# EAGLE design stm32board (EAGLE 9.6.2)
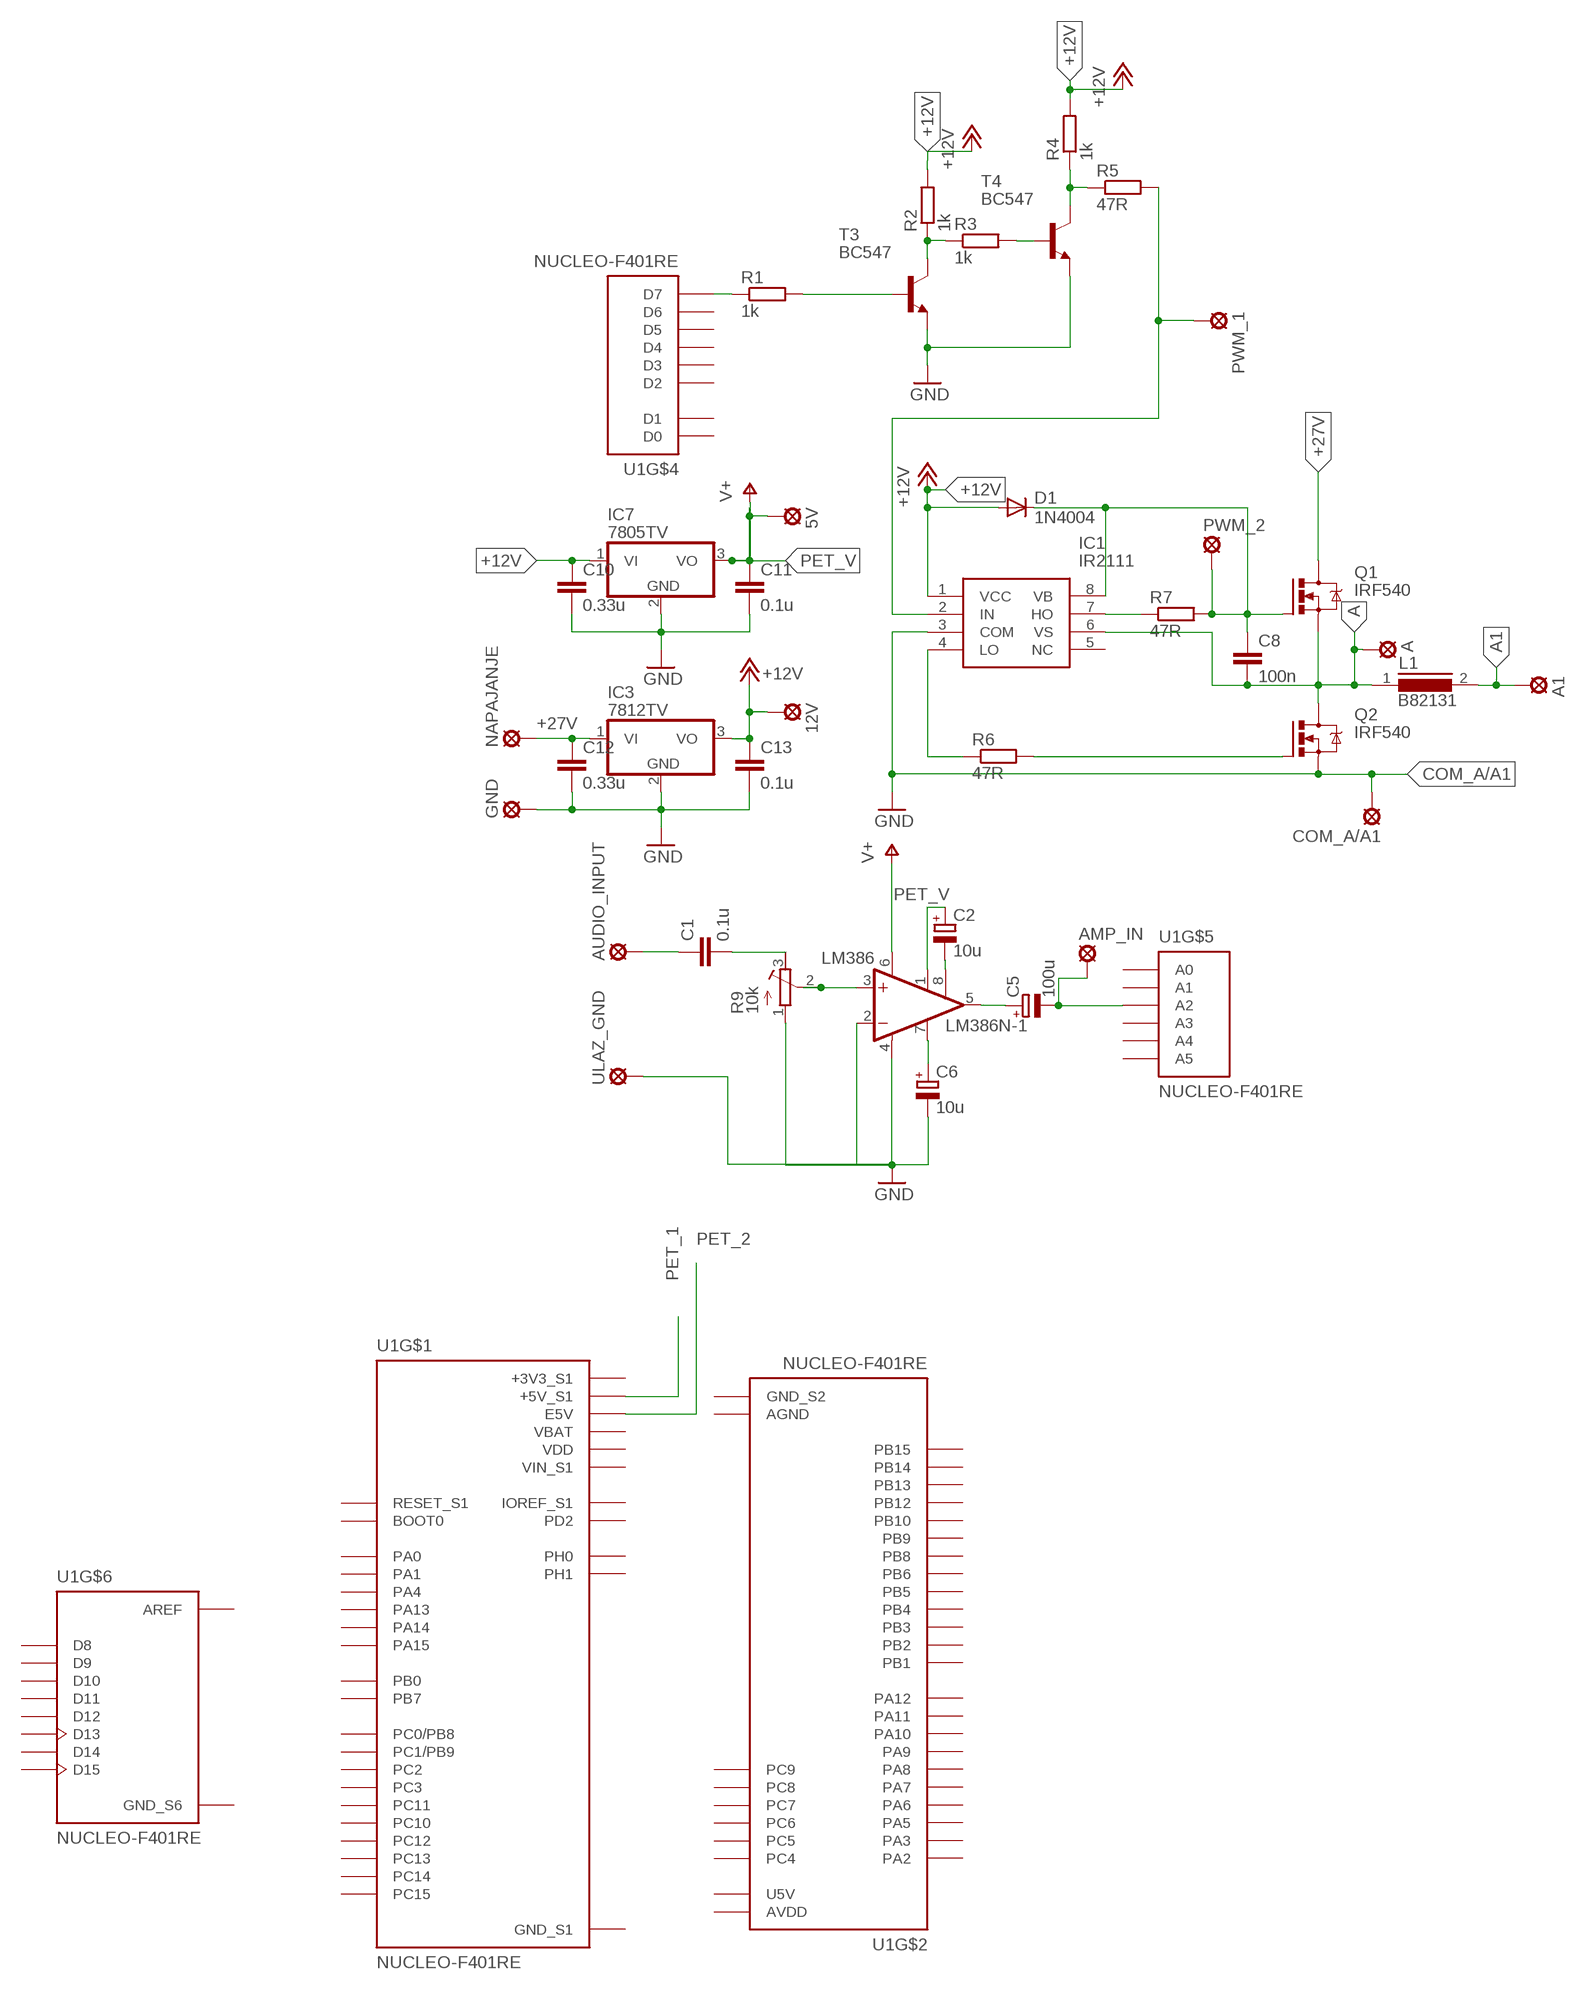
[diagram p0: schematic, sheet 1]

## Parts
5V  LSP10  [LSP10]
12V  LSP10  [LSP10]
A  LSP10  [LSP10]
A1  LSP10  [LSP10]
AMP_IN  LSP10  [LSP10]
AUDIO_INPUT  LSP10  [LSP10]
C1  0.1u  C-EU050-030X075  [C050-030X075]
C2  10u  CPOL-EUE2,5-6E  [E2,5-6E]
C5  100u  CPOL-EUE2,5-6E  [E2,5-6E]
C6  10u  CPOL-EUE2,5-6E  [E2,5-6E]
C8  100n  C-EU050-030X075  [C050-030X075]
C10  0.33u  C-EU050-030X075  [C050-030X075]
C11  0.1u  C-EU050-030X075  [C050-030X075]
C12  0.33u  C-EU050-030X075  [C050-030X075]
C13  0.1u  C-EU050-030X075  [C050-030X075]
COM_A/A1  LSP10  [LSP10]
D1  1N4004  [DO41-10]
GND  LSP10  [LSP10]
IC1  IR2111  [DIP762W56P254L988H533Q8N]
IC3  7812TV  [TO220V]
IC7  7805TV  [TO220V]
L1  B82131  [SUKW1-17]
LM386  LM386N-1  [DIL08]
NAPAJANJE  LSP10  [LSP10]
PWM_1  LSP10  [LSP10]
PWM_2  LSP10  [LSP10]
Q1  IRF540  [TO220BV]
Q2  IRF540  [TO220BV]
R1  1k  R-EU_0207/12  [0207/12]
R2  1k  R-EU_0207/12  [0207/12]
R3  1k  R-EU_0207/12  [0207/12]
R4  1k  R-EU_0207/12  [0207/12]
R5  47R  R-EU_0207/12  [0207/12]
R6  47R  R-EU_0207/12  [0207/12]
R7  47R  R-EU_0207/12  [0207/12]
R9  10k  R-TRIMM3339P  [RTRIM3339P]
T3  BC547  [TO92]
T4  BC547  [TO92]
U1  NUCLEO-F401RE  [ST_NUCLEO-F401RE]
ULAZ_GND  LSP10  [LSP10]

## Nets
+12V: 12V.MP C10.1 C13.1 D1.A IC1.1(VCC) IC3.3(VO) IC7.1(VI) R2.2 R4.2
+27V: C12.1 IC3.1(VI) NAPAJANJE.MP Q1.D
A: A.MP C8.2 IC1.6(VS) L1.1 Q1.S Q2.D
A1: A1.MP L1.2
AUDIO_INPUT: AUDIO_INPUT.MP C1.1
COM_A/A1: COM_A/A1.MP IC1.3(COM) Q2.S ; supply symbol labelled GND
GND: C6.- C10.2 C11.2 C12.2 C13.2 GND.MP IC3.2(GND) IC7.2(GND) LM386.2(-IN) LM386.4(GND) R9.1(A) T3.1(E) T4.1(E) ULAZ_GND.MP
N$1: C5.+ LM386.5(OUT)
N$2: AMP_IN.MP C5.- U1.CN8_3(A2)
N$3: C2.- LM386.8(GAIN)
N$4: C6.+ LM386.7(BYPASS)
N$5: R1.1 U1.CN9_8(D7)
N$7: C1.2 R9.3(E)
N$8: C2.+ LM386.1(GAIN)
N$9: LM386.3(+IN) R9.2(S)
N$10: R1.2 T3.2(B)
N$11: R2.1 R3.1 T3.3(C)
N$12: R4.1 R5.1 T4.3(C)
N$13: R3.2 T4.2(B)
N$18: IC1.7(HO) R7.1
N$19: C8.1 D1.C IC1.8(VB) PWM_2.MP Q1.G R7.2
N$21: IC1.4(LO) R6.1
N$22: Q2.G R6.2
N$24: IC1.2(IN) PWM_1.MP R5.2
PET_1: U1.CN7_18(+5V_S1)
PET_2: U1.CN7_6(E5V)
PET_V: 5V.MP C11.1 IC7.3(VO) LM386.6(VS) ; supply symbol labelled V+
Unconnected: IC1.5(NC) U1.CN5_1(D8) U1.CN5_2(D9) U1.CN5_3(D10) U1.CN5_4(D11) U1.CN5_5(D12) U1.CN5_6(D13) U1.CN5_9(D14) U1.CN5_10(D15) U1.CN6_2(IOREF) U1.CN6_3(RESET) U1.CN7_1(PC10) U1.CN7_2(PC11) U1.CN7_3(PC12) U1.CN7_4(PD2) U1.CN7_7(BOOT0) U1.CN7_12(IOREF_S1) U1.CN7_13(PA13) U1.CN7_14(RESET_S1) U1.CN7_15(PA14) U1.CN7_17(PA15) U1.CN7_21(PB7) U1.CN7_23(PC13) U1.CN7_25(PC14) U1.CN7_27(PC15) U1.CN7_28(PA0) U1.CN7_29(PH0) U1.CN7_30(PA1) U1.CN7_31(PH1) U1.CN7_32(PA4) U1.CN7_34(PB0) U1.CN7_35(PC2) U1.CN7_36(PC1/PB9) U1.CN7_37(PC3) U1.CN7_38(PC0/PB8) U1.CN8_1(A0) U1.CN8_2(A1) U1.CN8_4(A3) U1.CN8_5(A4) U1.CN8_6(A5) U1.CN9_1(D0) U1.CN9_2(D1) U1.CN9_3(D2) U1.CN9_4(D3) U1.CN9_5(D4) U1.CN9_6(D5) U1.CN9_7(D6) U1.CN10_1(PC9) U1.CN10_2(PC8) U1.CN10_3(PB8) U1.CN10_4(PC6) U1.CN10_5(PB9) U1.CN10_6(PC5) U1.CN10_11(PA5) U1.CN10_12(PA12) U1.CN10_13(PA6) U1.CN10_14(PA11) U1.CN10_15(PA7) U1.CN10_16(PB12) U1.CN10_17(PB6) U1.CN10_19(PC7) U1.CN10_21(PA9) U1.CN10_22(PB2) U1.CN10_23(PA8) U1.CN10_24(PB1) U1.CN10_25(PB10) U1.CN10_26(PB15) U1.CN10_27(PB4) U1.CN10_28(PB14) U1.CN10_29(PB5) U1.CN10_30(PB13) U1.CN10_31(PB3) U1.CN10_33(PA10) U1.CN10_34(PC4) U1.CN10_35(PA2) U1.CN10_37(PA3)

## Power pins joined to a net without a drawn wire
+3V3: U1.CN6_4(+3V3)
+3V3_S1: U1.CN7_16(+3V3_S1)
AGND: U1.CN10_32(AGND)
AREF: U1.CN5_8(AREF)
AVDD: U1.CN10_7(AVDD)
GND: U1.CN6_6(GND) U1.CN6_7(GND)
GND_S1: U1.CN7_8(GND_S1) U1.CN7_19(GND_S1) U1.CN7_20(GND_S1) U1.CN7_22(GND_S1)
GND_S2: U1.CN10_9(GND_S2) U1.CN10_20(GND_S2)
GND_S6: U1.CN5_7(GND_S6)
PET_V: U1.CN6_5(+5V)
U5V: U1.CN10_8(U5V)
VBAT: U1.CN7_33(VBAT)
VDD: U1.CN7_5(VDD)
VIN: U1.CN6_8(VIN)
VIN_S1: U1.CN7_24(VIN_S1)

## Library data of the parts
5V 12V A A1 AMP_IN AUDIO_INPUT COM_A/A1 GND NAPAJANJE PWM_1 PWM_2 ULAZ_GND = solpad:LSP10: SOLDER PAD drill 1.0 mm, distributor Buerklin, 12H555
C1 C8 C10-C13 = rcl:C-EU: CAPACITOR, European symbol; SPICEPREFIX: C
C2 C5 C6 = rcl:CPOL-EU: POLARIZED CAPACITOR, European symbol; SPICEPREFIX: C
D1 = adafruit:1N4004: DIODE General purpose 1N400x type rectifier (With bigger pads) http://www.ladyada.net/library/pcb/eaglelibrary.html
IC1 = IR2111:IR2111: MOSFET/IGBT driver IR2111 DIP8 200mA Source: Datasheet <http://uk.rs-online.com/web/p/products/1890501>; DESCRIPTION: MOSFET/IGBT driver IR2111 DIP8 200mA; HEIGHT: 5.33mm; MANUFACTURER_NAME: Infineon; MANUFACTURER_PART_NUMBER: IR2111
IC3 IC7 = linear:78*: Positive VOLTAGE REGULATOR Source: http://cache.national.com/ds/LM/LM78L05.pdf http://www.fairchildsemi.com/ds/LM/LM7805.pdf
L1 = inductors:B82131: INDUCTOR; SPICEPREFIX: L
LM386 = linear:LM386?-*: Low Voltage Audio Power Amplifier Source: http://cache.national.com/ds/LM/LM386.pdf
Q1 Q2 = transistor-power:IRF540: HEXFET Power MOSFET
R1-R7 = rcl:R-EU_: RESISTOR, European symbol; SPICEPREFIX: R
R9 = rcl:R-TRIMM: Trimm resistor; SPICEMODEL: X; SPICEPREFIXL: POT
T3 T4 = transistor:BC547: NPN TRANSISTOR
U1 = NUCLEO-F401RE:NUCLEO-F401RE: STM32 Nucleo-64 development board with STM32F401RET6 MCU, supports Arduino and ST morpho connectivity Check availability <https://pricing.snapeda.com/parts/NUCLEO-F401RE/STMicroelectronics/view-part?ref=eda>; AVAILABILITY: In Stock; DESCRIPTION: STM32F401RE, mbed-Enabled Development Nucleo-64 STM32F4 ARM® Cortex®-M4 MCU 32-Bit Embedded Evaluation Board; MF: STMicroelectronics; MP: NUCLEO-F401RE; PACKAGE: None; PRICE: None; PURCHASE-URL: https://pricing.snapeda.com/search/part/NUCLEO-F401RE/?ref=eda

## Board
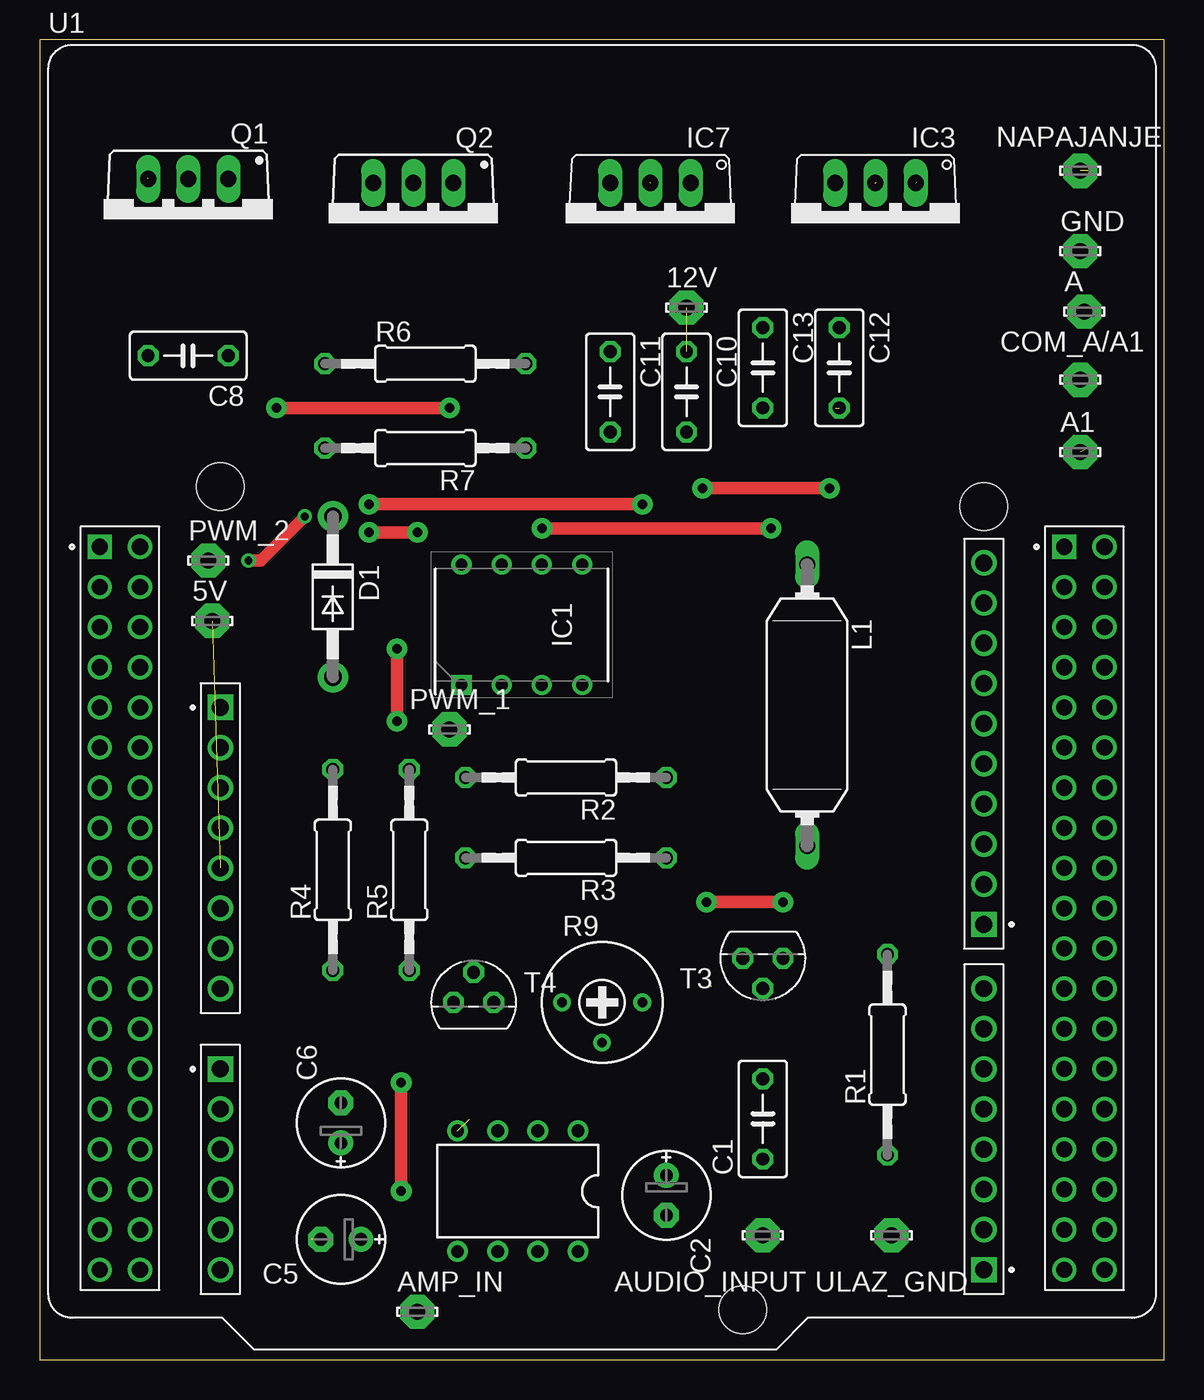
[diagram p1: board, top side]
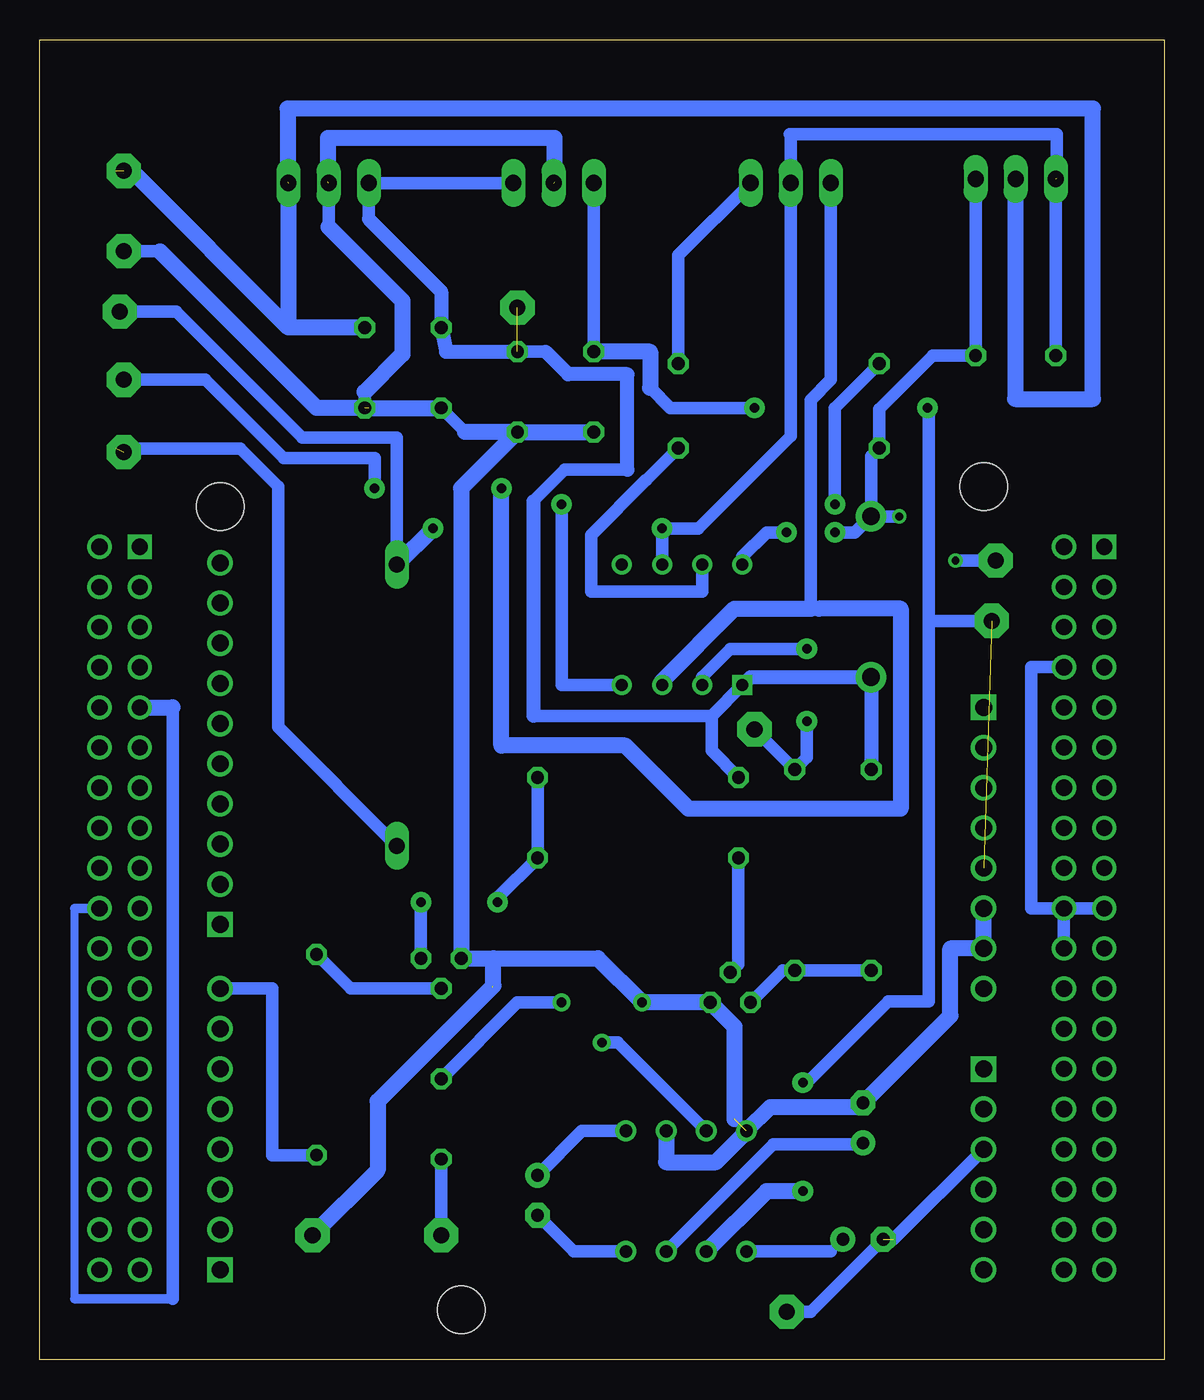
[diagram p2: board, bottom side, seen from below]

Size 71.1 x 83.49 mm. Coordinates in mm from the lower left corner, seen from the top.
Outline: 0,0 71.1,0 71.1,83.49 0,83.49 0,0
Copper layers (1*16): Top 0.035mm / dielectric 1.5mm / Bottom 0.035mm
Design rules "default *": minimum track width 0.8mm, minimum drill 0.5mm, track to track 10mil, track to pad 10mil, pad to pad 10mil, via to via 10mil, smd to smd 10mil, copper to edge 70mil, drill to drill 15mil, minimum pad ring 10mil, minimum via ring 8mil, stop-mask expansion 4mil, vias tented up to drill 0mil, thermal gap 10mil

### Footprints (pad centres in the part's own frame; a part is rotated, then mirrored left to right if it is on the bottom)
LSP10 = drill 1.016 pad 2.159 octagon: MP 0,0
C050-030X075 = drill 0.813 octagon: 1 -2.54,0; 2 2.54,0
E2,5-6E = drill 0.813 pad 1.575: + -1.27,0 | drill 0.813 pad 1.575 octagon: - 1.27,0
DO41-10 = drill 1.118 pad 1.93: A 5.08,0; C -5.08,0
DIP762W56P254L988H533Q8N = drill 0.758 pad 1.158 square: 1 -3.81,3.81 | drill 0.758 pad 1.158: 2 -3.81,1.27; 3 -3.81,-1.27; 4 -3.81,-3.81; 5 3.81,-3.81; 6 3.81,-1.27; 7 3.81,1.27; 8 3.81,3.81
TO220V = drill 1.016 long: 1 -2.54,-2.54; 2 0,-2.54; 3 2.54,-2.54
SUKW1-17 = drill 1.016 long: 1 -8.89,0; 2 8.89,0
DIL08 = drill 0.813 pad 1.27: 1 -3.81,-3.81; 2 -1.27,-3.81; 3 1.27,-3.81; 4 3.81,-3.81; 5 3.81,3.81; 6 1.27,3.81; 7 -1.27,3.81; 8 -3.81,3.81
TO220BV = drill 1.016 long: D 0,-2.54; G -2.54,-2.54; S 2.54,-2.54
0207/12 = drill 0.813 octagon: 1 -6.35,0; 2 6.35,0
RTRIM3339P = drill 0.61: 1 -2.54,0; 2 0,-2.54; 3 2.54,0
TO92 = drill 0.813 octagon: 1 1.27,0; 2 0,1.905; 3 -1.27,0
ST_NUCLEO-F401RE = drill 1.07 square: CN5_1 24.13,-14.37; CN6_1 -24.13,-0.65; CN8_1 -24.13,-23.51; CN9_1 24.13,-36.21 | drill 1.07: CN5_2 24.13,-11.83; CN5_3 24.13,-9.29; CN5_4 24.13,-6.75; CN5_5 24.13,-4.21; CN5_6 24.13,-1.67; CN5_7 24.13,0.87; CN5_8 24.13,3.41; CN5_9 24.13,5.95; CN5_10 24.13,8.49; CN6_2 -24.13,-3.19; CN6_3 -24.13,-5.73; CN6_4 -24.13,-8.27; CN6_5 -24.13,-10.81; CN6_6 -24.13,-13.35; CN6_7 -24.13,-15.89; CN6_8 -24.13,-18.43; CN8_2 -24.13,-26.05; CN8_3 -24.13,-28.59; CN8_4 -24.13,-31.13; CN8_5 -24.13,-33.67; CN8_6 -24.13,-36.21; CN9_2 24.13,-33.67; CN9_3 24.13,-31.13; CN9_4 24.13,-28.59; CN9_5 24.13,-26.05; CN9_6 24.13,-23.51; CN9_7 24.13,-20.97; CN9_8 24.13,-18.43 | drill 1.02 square: CN7_1 -31.75,9.51; CN10_1 29.21,9.51 | drill 1.02: CN7_2 -29.21,9.51; CN7_3 -31.75,6.97; CN7_4 -29.21,6.97; CN7_5 -31.75,4.43; CN7_6 -29.21,4.43; CN7_7 -31.75,1.89; CN7_8 -29.21,1.89; CN7_9 -31.75,-0.65; CN7_10 -29.21,-0.65; CN7_11 -31.75,-3.19; CN7_12 -29.21,-3.19; CN7_13 -31.75,-5.73; CN7_14 -29.21,-5.73; CN7_15 -31.75,-8.27; CN7_16 -29.21,-8.27; CN7_17 -31.75,-10.81; CN7_18 -29.21,-10.81; CN7_19 -31.75,-13.35; CN7_20 -29.21,-13.35; CN7_21 -31.75,-15.89; CN7_22 -29.21,-15.89; CN7_23 -31.75,-18.43; CN7_24 -29.21,-18.43; CN7_25 -31.75,-20.97; CN7_26 -29.21,-20.97; CN7_27 -31.75,-23.51; CN7_28 -29.21,-23.51; CN7_29 -31.75,-26.05; CN7_30 -29.21,-26.05; CN7_31 -31.75,-28.59; CN7_32 -29.21,-28.59; CN7_33 -31.75,-31.13; CN7_34 -29.21,-31.13; CN7_35 -31.75,-33.67; CN7_36 -29.21,-33.67; CN7_37 -31.75,-36.21; CN7_38 -29.21,-36.21; CN10_2 31.75,9.51; CN10_3 29.21,6.97; CN10_4 31.75,6.97; CN10_5 29.21,4.43; CN10_6 31.75,4.43; CN10_7 29.21,1.89; CN10_8 31.75,1.89; CN10_9 29.21,-0.65; CN10_10 31.75,-0.65; CN10_11 29.21,-3.19; CN10_12 31.75,-3.19; CN10_13 29.21,-5.73; CN10_14 31.75,-5.73; CN10_15 29.21,-8.27; CN10_16 31.75,-8.27; CN10_17 29.21,-10.81; CN10_18 31.75,-10.81; CN10_19 29.21,-13.35; CN10_20 31.75,-13.35; CN10_21 29.21,-15.89; CN10_22 31.75,-15.89; CN10_23 29.21,-18.43; CN10_24 31.75,-18.43; CN10_25 29.21,-20.97; CN10_26 31.75,-20.97; CN10_27 29.21,-23.51; CN10_28 31.75,-23.51; CN10_29 29.21,-26.05; CN10_30 31.75,-26.05; CN10_31 29.21,-28.59; CN10_32 31.75,-28.59; CN10_33 29.21,-31.13; CN10_34 31.75,-31.13; CN10_35 29.21,-33.67; CN10_36 31.75,-33.67; CN10_37 29.21,-36.21; CN10_38 31.75,-36.21 | hole 3: 8.89,-38.75; 24.13,12.05; -24.13,13.32

### Placement (x,y rotation side)
5V  10.92,46.74 0 top
12V  40.89,66.55 0 top
A  66.04,66.29 0 top
A1  65.79,57.4 0 top
AMP_IN  23.88,3.05 0 top
AUDIO_INPUT  45.72,7.87 0 top
C1  45.72,15.24 90 top
C2  39.62,10.41 270 top
C5  19.05,7.62 180 top
C6  19.05,14.99 90 top
C8  9.4,63.5 180 top
C10  40.89,61.21 270 top
C11  36.07,61.21 270 top
C12  50.55,62.74 270 top
C13  45.72,62.74 270 top
COM_A/A1  65.79,61.98 0 top
D1  18.54,48.26 270 top
GND  65.79,70.1 0 top
IC1  30.48,46.48 90 top
IC3  52.83,71.88 180 top
IC7  38.61,71.88 180 top
L1  48.51,41.4 270 top
LM386  30.23,10.67 180 top
NAPAJANJE  65.79,75.18 0 top
PWM_1  25.91,39.88 0 top
PWM_2  10.67,50.55 0 top
Q1  9.4,72.14 180 top
Q2  23.62,71.88 180 top
R1  53.59,19.3 90 top
R2  33.27,36.83 180 top
R3  33.27,31.75 180 top
R4  18.54,30.99 90 top
R5  23.37,30.99 90 top
R6  24.38,62.99 0 top
R7  24.38,57.66 180 top
R9  35.56,22.61 0 top
T3  45.72,25.4 180 top
T4  27.43,22.61 0 top
U1  35.56,41.91 0 top
ULAZ_GND  53.85,7.87 0 top

### Tracks (layer width: path | path; a pad name or v marks a point on that pad's centre or on a via)
+12V  (1 unrouted)
  Bottom 0.8: 50.29,72.14 IC3.3 IC7.1 | 39.12,63.75 C10.1 | 39.89,54.3 37.9,56.29 33.94,56.29 | 39.89,40.72 28.62,40.72 | 28.62,40.72 IC1.1 | R2.2 28.62,38.52 28.62,40.72
  Bottom 0.9: IC1.1 26.16,43.18 D1.A R4.2 | 50.29,72.14 45.72,67.56 C13.1 45.4,63.75 C10.1 | 39.89,54.3 39.89,40.72 | 33.94,56.29 33.94,62.33 37.69,62.33 39.12,63.75
+27V  (2 unrouted)
  Bottom 0.8: Q1.D 9.44,74.63 | 65.28,75.18 66.29,75.18
  Bottom 1: IC3.1 55.37,65.28 | C12.1 55.37,65.28 | 55.42,74.47 55.42,79.13 4.53,79.13 4.53,60.76 9.44,60.76 9.44,74.63 | 55.37,65.28 65.28,75.18
A  (via drill 0.6 pad 1.3)  (1 unrouted)
  Top 0.8: v31.75,52.58 v46.23,52.58
  Bottom 0.8: 6.81,74.72 6.81,77.52 23.67,77.52 23.62,77.47 Q2.D 23.62,58.42 29.46,52.58 v31.75,52.58 IC1.6 | C8.2 Q1.S | L1.1 48.51,58.33 54.48,58.33 62.45,66.29 A.MP
  Bottom 1: v46.23,52.58 L1.1
A1  (1 unrouted)
  Bottom 0.8: L1.2 56.01,40.01 56.01,55.23 58.42,57.64 66.27,57.64 66.29,57.66
AUDIO_INPUT
  Bottom 0.8: AUDIO_INPUT.MP C1.1
COM_A/A1  (via drill 0.6 pad 1.3)
  Top 0.8: v49.92,55.12 v41.91,55.12
  Bottom 0.6: 21.84,47.5 22.35,47.5
  Bottom 0.8: Q2.S 21.08,61.98 22.35,60.71 22.35,47.5 | v49.92,55.12 49.92,57.02 55.68,57.02 60.64,61.98 COM_A/A1.MP
  Bottom 1: v41.91,55.12 41.91,38.85 34.07,38.85 30.07,34.85 16.67,34.85 16.67,47.5 21.84,47.5 | 22.35,47.5 27.18,47.5 31.75,42.93 IC1.3
GND  (5 unrouted)
  Bottom 0.6: LM386.4 26.42,14.43
  Bottom 0.8: 44.2,58.67 C13.2 | IC3.2 52.83,71.63 | 50.55,61.21 C12.2 | 63.5,70.1 GND.MP
  Bottom 1: 42.42,25.4 T3.1 44.45,55.12 C10.2 | 42.42,25.4 35.81,25.4 R9.1 T4.1 27.18,21.08 27.18,15.24 | U1.CN6_6 U1.CN6_7 13.54,26.02 13.54,21.77 C6.- 19.3,16 24.89,16 LM386.4 | ULAZ_GND.MP 49.73,11.99 49.73,16.36 42.48,23.6 | 38.56,74.47 38.56,77.26 52.88,77.26 52.88,74.47 | C10.2 C11.2 | 50.29,60.2 C13.2 | LM386.2 31.5,12.5 28.35,12.5 26.42,14.43 | 42.42,23.67 42.42,25.4 | C10.2 44.2,58.67 | 52.83,71.63 48.16,66.97 48.16,63.59 50.55,61.21 | C12.2 53.59,60.2 63.5,70.1
GND_S1
  Bottom 0.8: U1.CN7_19 U1.CN7_20 | U1.CN7_20 U1.CN7_22 | U1.CN7_20 8.43,28.56 8.43,43.8 U1.CN7_8
GND_S2
  Bottom 0.5: 68.88,3.87 68.88,28.56
  Bottom 0.6: 62.69,3.87 68.88,3.87 | U1.CN10_20 68.88,28.56
  Bottom 0.8: 62.69,41.26 62.69,3.87
  Bottom 1: U1.CN10_9 62.69,41.26
N$1
  Bottom 0.6: C5.+ 21.08,6.86
  Bottom 0.8: 21.08,6.86 LM386.5
N$2  (1 unrouted)
  Bottom 0.8: 17.13,7.62 U1.CN8_3 | C5.- 22.35,3.05 AMP_IN.MP
N$3
  Bottom 0.8: LM386.8 37.34,6.86 C2.-
N$4
  Bottom 0.6: C6.+ 19.14,13.62
  Bottom 0.8: 19.14,13.62 24.73,13.62 LM386.7
N$5
  Bottom 0.8: R1.1 56.39,12.95 56.39,23.48 U1.CN9_8
N$7
  Bottom 0.8: R9.3 40.89,22.61 C1.2
N$8
  Bottom 0.8: C2.+ 36.83,14.48 LM386.1
N$9
  Bottom 0.8: R9.2 34.54,20.07 LM386.3
N$10
  Bottom 0.8: T3.2 51.44,23.5 R1.2
N$11  (via drill 0.6 pad 1.3)
  Top 0.8: v46.99,28.96 v42.16,28.96
  Bottom 0.6: v42.16,28.96 42.16,29.21
  Bottom 0.8: T3.3 v46.99,28.96 | 42.16,29.21 R3.1 R2.1
N$12
  Bottom 0.6: 24.13,24.64 R5.1
  Bottom 0.8: T4.3 24.13,24.64 | R5.1 R4.1
N$13
  Bottom 0.8: R3.2 26.92,25.02 T4.2
N$18
  Bottom 0.8: IC1.7 29.21,48.6 36.24,48.6 36.24,52.16 32.77,55.63 R7.1
N$19  (via drill 0.5, 0.6 pad 1.3)
  Top 0.8: v23.88,52.32 v20.83,52.32 | v16.76,53.34 13.97,50.55 v13.21,50.55
  Bottom 0.8: Q1.G C8.1 14.66,63.5 18.03,60.12 R7.2 18.54,57.15 D1.C | IC1.8 26.67,50.8 25.15,52.32 v23.88,52.32 | v20.83,52.32 19.56,52.32 D1.C | D1.C v16.76,53.34 | v13.21,50.55 PWM_2.MP
N$21  (via drill 0.6 pad 1.3)
  Top 0.8: v38.1,54.1 25.4,54.1 v20.83,54.1
  Bottom 0.8: IC1.4 38.1,42.67 v38.1,54.1 | v20.83,54.1 20.83,60.2 R6.1
N$22
  Bottom 0.8: Q2.G 30.73,69.85 R6.2
N$24  (via drill 0.6 pad 1.3)
  Top 0.8: v22.61,40.39 v22.61,44.96
  Bottom 0.8: v22.61,44.96 27.45,44.96 29.21,43.2 IC1.2 | PWM_1.MP R5.2 22.61,38.1 v22.61,40.39
PET_V  (via drill 0.6 pad 1.3)  (1 unrouted)
  Top 0.8: v22.86,10.67 v22.86,17.53 | v14.99,60.2 v25.91,60.2
  Bottom 0.8: v22.86,17.53 22.61,17.53 17.47,22.66 14.9,22.66 14.9,46.74 | v25.91,60.2 31.24,60.2 32.51,61.47 | v14.99,60.2 14.9,60.11 14.9,46.74 | IC7.3 C11.1 | 5V.MP 14.9,46.74
  Bottom 1: C11.1 32.51,63.75 32.51,61.47 | LM386.6 25.15,10.67 v22.86,10.67